# EAGLE design tx_board (EAGLE 7.7.0)
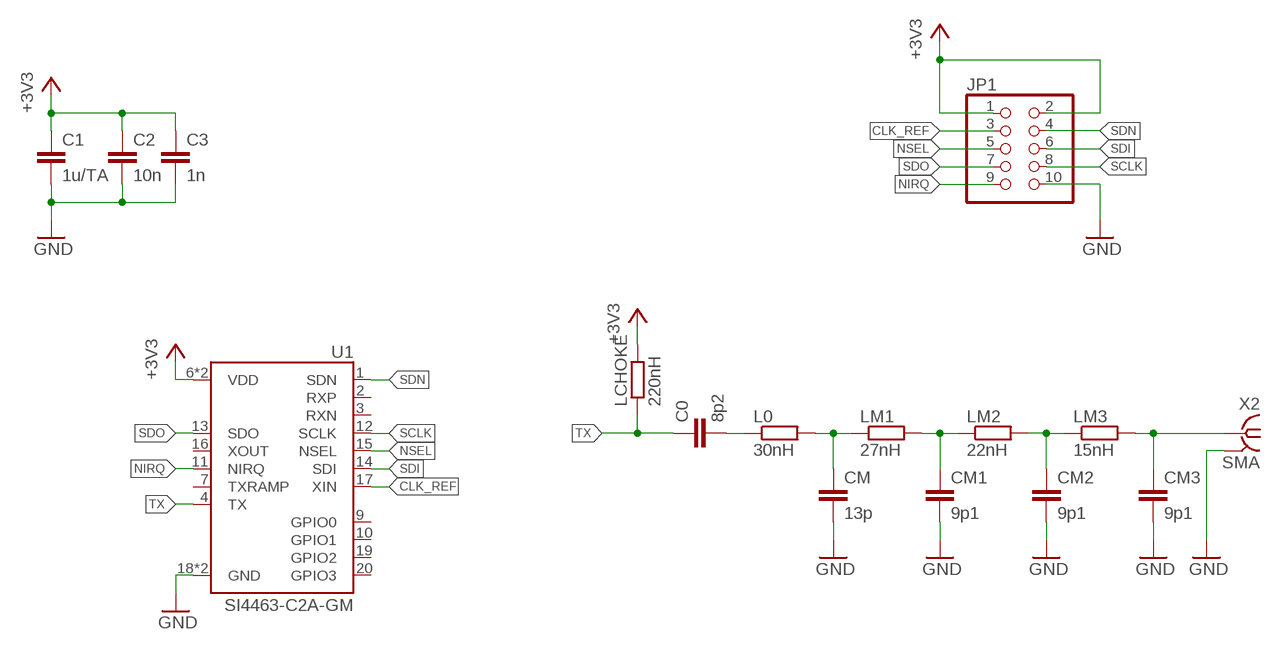
[diagram p0: schematic, sheet 1]

## Parts
C0  8p2  C-EUC0805  [C0805]
C1  1u/TA  C-EUC1206  [C1206]
C2  10n  C-EUC0805  [C0805]
C3  1n  C-EUC0805  [C0805]
CM  13p  C-EUC0805  [C0805]
CM1  9p1  C-EUC0805  [C0805]
CM2  9p1  C-EUC0805  [C0805]
CM3  9p1  C-EUC0805  [C0805]
JP1  PINHD-2X5/90  [2X05/90]
L0  30nH  R-EU_R0805  [R0805]
LCHOKE  220nH  R-EU_R0805  [R0805]
LM1  27nH  R-EU_R0805  [R0805]
LM2  22nH  R-EU_R0805  [R0805]
LM3  15nH  R-EU_R0805  [R0805]
U1  SI4463-C2A-GM  [QFN50P400X400X90-20N]
X2  SMA  SMA-142-0701-871/876  [J502-ND-142-0701-871/876]

## Nets
+3V3 [pwr]: C1.1 C2.1 C3.1 JP1.1 JP1.2 LCHOKE.2 U1.6(VDD) U1.8(VDD)
CLK_REF: JP1.3 U1.17(XIN)
GND [pwr]: C1.2 C2.2 C3.2 CM1.2 CM2.2 CM3.2 CM.2 JP1.10 U1.18(GND) U1.21(GND) X2.G@1 X2.G@2 X2.G@3 X2.G@4
N$2: CM2.1 LM2.2 LM3.1
N$21 [rf]: CM3.1 LM3.2 X2.1
N$23 [rf]: C0.2 L0.1
N$24 [rf]: CM.1 L0.2 LM1.1
N$25 [rf]: CM1.1 LM1.2 LM2.1
NIRQ: JP1.9 U1.11(NIRQ)
NSEL: JP1.5 U1.15(NSEL)
SCLK: JP1.8 U1.12(SCLK)
SDI: JP1.6 U1.14(SDI)
SDN: JP1.4 U1.1(SDN)
SDO: JP1.7 U1.13(SDO)
TX: C0.1 LCHOKE.1 U1.4(TX)
Unconnected: U1.2(RXP) U1.3(RXN) U1.7(TXRAMP) U1.9(GPIO0) U1.10(GPIO1) U1.16(XOUT) U1.19(GPIO2) U1.20(GPIO3)

## Library data of the parts
C0 C1-C3 CM CM1-CM3 = rcl:C-EU: CAPACITOR, European symbol
JP1 = pinhead:PINHD-2X5: PIN HEADER
L0 LCHOKE LM1-LM3 = resistor:R-EU_: RESISTOR, European symbol
U1 = SI4463-C2A-GM:SI4463-C2A-GM: RF Transceiver FSK/GFSK/GMSK/MSK/OOK 3.3V 20-Pin QFN EP; AVAILABILITY: Unavailable; DESCRIPTION: RF Transceiver FSK/GFSK/GMSK/MSK/OOK 3.3V 20-Pin QFN EP; MF: Silicon Labs; MP: SI4463-C2A-GM; PACKAGE: VFQFN-20 Silicon Labs; PRICE: None
X2 = con-coax:SMA-: SMA 50 Ohm End Launch Jack Receptacle - Round Contact Johnson Components Source: www.johnsoncomponents.com .. J502-ND.pdf; MF: JOHNSON COMPONENTS; MPN: 142-0701-871; OC_FARNELL: 1339835; OC_NEWARK: 91B6105

## Net classes
1 pwr: width 0.5 mm, drill 0.2 mm, clearance 0.127 mm
2 rf: width 0.5 mm, drill 0.2 mm, clearance 0.1 mm

## Board
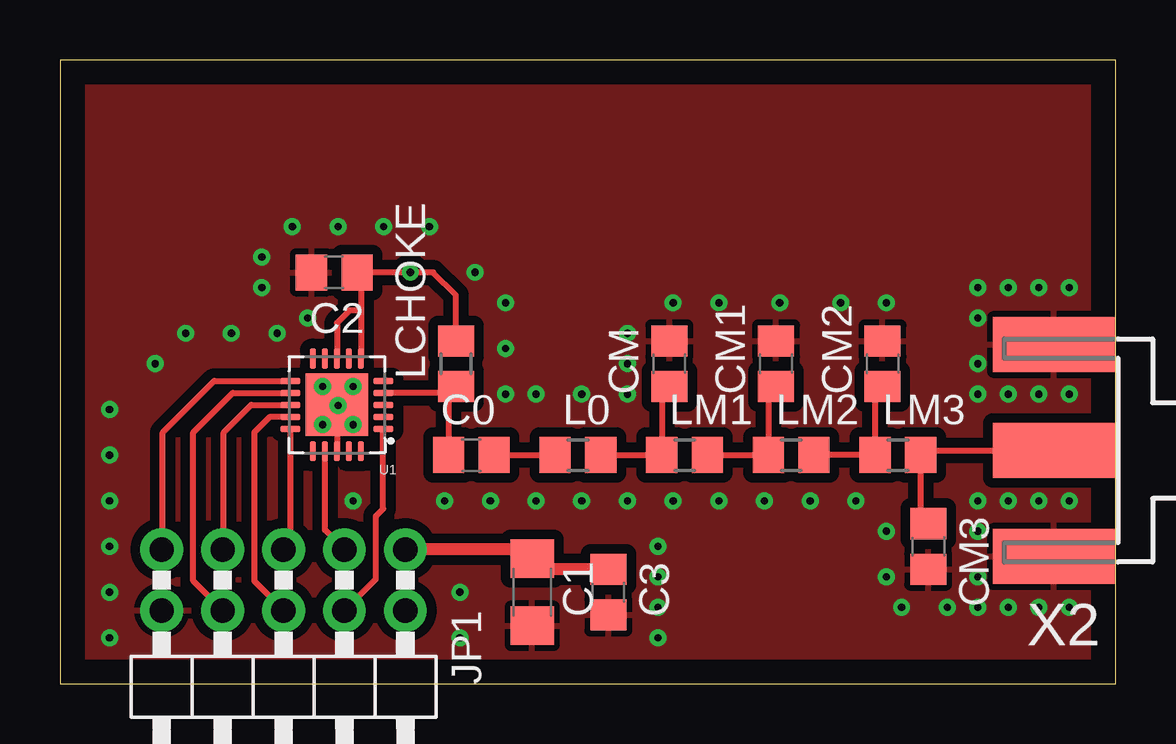
[diagram p1: board, top side]
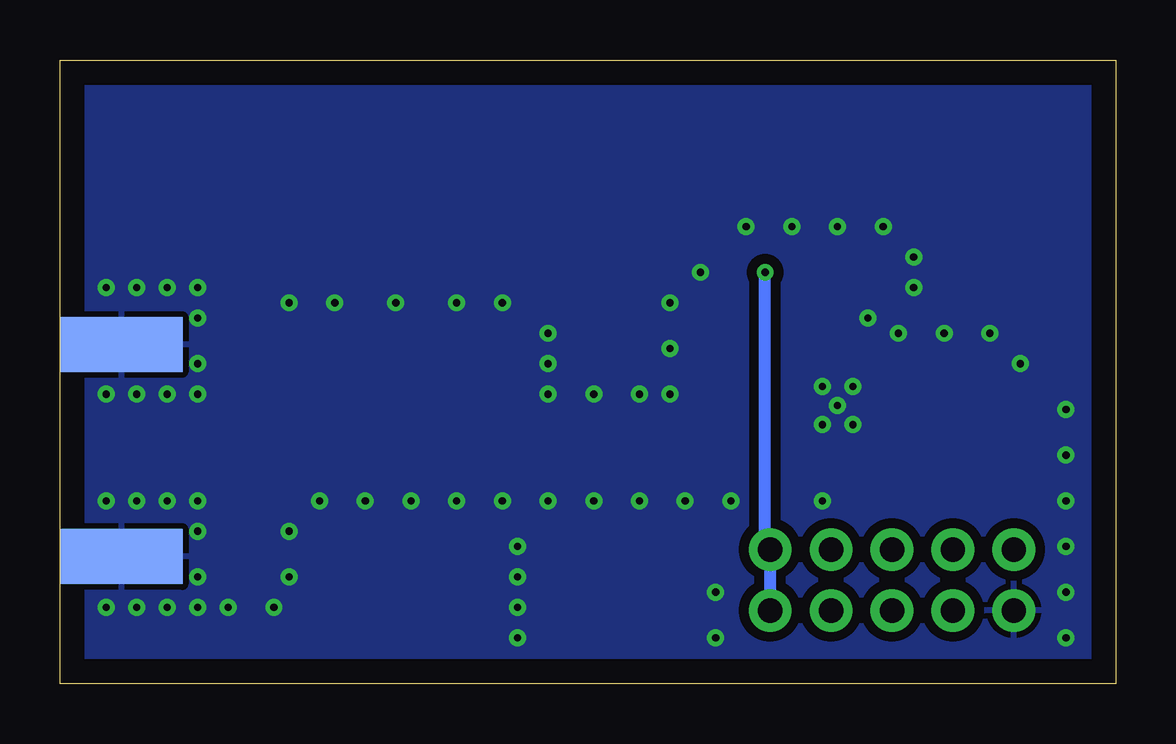
[diagram p2: board, bottom side, seen from below]

Size 44 x 26 mm. Coordinates in mm from the lower left corner, seen from the top.
Outline: 0,0 44,0 44,26 0,26 0,0
Copper layers (1*16): Top 0.035mm / dielectric 1.5mm / Bottom 0.035mm
Design rules "default *": minimum track width 10mil, minimum drill 24mil, track to track 8mil, track to pad 8mil, pad to pad 8mil, via to via 8mil, smd to smd 8mil, copper to edge 40mil, drill to drill 8mil, minimum pad ring 10mil, minimum via ring 8mil, stop-mask expansion 4mil, vias tented up to drill 0.3mm, thermal gap 10mil

### Footprints (pad centres in the part's own frame; a part is rotated, then mirrored left to right if it is on the bottom)
C0805 = smd 1.3 x 1.5: 1 -0.95,0; 2 0.95,0
C1206 = smd 1.6 x 1.8: 1 -1.4,0; 2 1.4,0
2X05/90 = drill 1.016 pad 1.778: 1 -5.08,-6.35; 2 -5.08,-3.81; 3 -2.54,-6.35; 4 -2.54,-3.81; 5 0,-6.35; 6 0,-3.81; 7 2.54,-6.35; 8 2.54,-3.81; 9 5.08,-6.35; 10 5.08,-3.81
R0805 = smd 1.3 x 1.5: 1 -0.95,0; 2 0.95,0
QFN50P400X400X90-20N = smd 0.84 x 0.26: 1 -1.935,1; 2 -1.935,0.5; 3 -1.935,0; 4 -1.935,-0.5; 5 -1.935,-1; 11 1.935,-1; 12 1.935,-0.5; 13 1.935,0; 14 1.935,0.5; 15 1.935,1 | smd 0.26 x 0.84: 6 -1,-1.935; 7 -0.5,-1.935; 8 0,-1.935; 9 0.5,-1.935; 10 1,-1.935; 16 1,1.935; 17 0.5,1.935; 18 0,1.935; 19 -0.5,1.935; 20 -1,1.935 | smd 2.6 x 2.6: 21 0,0
J502-ND-142-0701-871/876 = smd 5.08 x 2.286: 1 2.565,0; G@1 2.565,4.42; G@2 2.565,-4.42 | smd 5.08 x 2.286 bottom: G@3 2.565,4.42; G@4 2.565,-4.42

### Placement (x,y rotation side)
C0  17.14,9.53 0 top
C1  19.68,3.81 270 top
C2  11.43,17.14 180 top
C3  22.86,3.81 270 top
CM  25.4,13.34 90 top
CM1  29.84,13.34 90 top
CM2  34.29,13.34 90 top
CM3  36.2,5.71 270 top
JP1  9.32,-0.76 180 top
L0  21.59,9.53 0 top
LCHOKE  16.51,13.34 90 top
LM1  26.04,9.53 0 top
LM2  30.48,9.53 0 top
LM3  34.92,9.53 0 top
U1  11.54,11.62 180 top
X2  44,9.71 180 top

### Tracks (layer width: path | path; a pad name or v marks a point on that pad's centre or on a via)
+3V3  (via drill 0.3)
  Top 0.254: 12.54,15.56 12.54,17.14 C2.1 v14.61,17.14 15.56,17.14 16.51,16.19 LCHOKE.2 | 12.54,15.56 U1.6 | 12.54,15.56 12.06,15.56 11.54,15.04 U1.8
  Top 0.508: C3.1 20,4.76 19.68,5.08 C1.1 19.31,5.59 JP1.1
  Bottom 0.508: v14.61,17.14 14.61,5.79 JP1.1 JP1.2
CLK_REF
  Top 0.254: JP1.3 11.04,6.41 U1.17
GND  (via drill 0.3)
  Top 0.254: U1.18 U1.21 11.54,11.79 v10.95,12.38
  other vias: 12.22,12.38 12.22,10.79 10.95,10.79 11.59,11.59 2.06,1.91 2.06,3.81 2.06,5.71 2.06,7.62 2.06,9.53 2.06,11.43 3.97,13.34 5.24,14.61 7.14,14.61 9.05,14.61 12.22,7.62 16.03,7.62 17.94,7.62 19.84,7.62 21.75,7.62 23.65,7.62 16.67,3.81 16.67,1.91 25.56,7.62 27.46,7.62 29.37,7.62 31.27,7.62 33.18,7.62 34.45,6.35 34.45,4.45 35.08,3.17 36.99,3.17 42.07,7.62 40.8,7.62 39.53,7.62 38.26,7.62 38.26,6.35 38.26,4.45 38.26,3.17 39.53,3.17 40.8,3.17 42.07,3.17 42.07,12.06 40.8,12.06 39.53,12.06 38.26,12.06 38.26,13.34 38.26,15.24 38.26,16.51 39.53,16.51 40.8,16.51 42.07,16.51 34.45,15.88 30,15.88 25.56,15.88 27.46,15.88 32.54,15.88 23.65,14.61 23.65,13.34 23.65,12.06 21.75,12.06 19.84,12.06 18.57,12.06 18.57,13.97 18.57,15.88 10.32,15.24 8.41,16.51 8.41,17.78 9.68,19.05 11.59,19.05 13.49,19.05 15.4,19.05 17.3,17.14 24.92,1.91 24.92,3.17 24.92,4.45 24.92,5.71
  pour Top (isolate 0.406): 0,26.04 43.97,26.04 43.97,0 0,0
  pour Bottom (isolate 0.406): 0,26.04 43.97,26.04 43.97,0 0,0
N$2
  Top 0.254: CM2.1 33.98,12.07 LM3.1 LM2.2
N$21
  Top 0.254: X2.1 36.06,9.71 LM3.2 35.88,6.99 CM3.1
N$23
  Top 0.254: C0.2 L0.1
N$24
  Top 0.254: L0.2 LM1.1 25.09,12.07 CM.1
N$25
  Top 0.254: CM1.1 29.53,12.07 LM2.1 LM1.2
NIRQ
  Top 0.254: JP1.9 4.29,5.63 4.29,10.48 6.43,12.62 U1.11
NSEL
  Top 0.254: JP1.5 9.61,5.88 U1.15
SCLK
  Top 0.254: JP1.8 5.56,4.27 5.56,10.48 7.2,12.12 U1.12
SDI
  Top 0.254: JP1.6 8.1,4.27 8.1,10.48 8.73,11.11 U1.14
SDN
  Top 0.254: JP1.4 13.18,4.36 13.18,6.99 13.48,7.29 U1.1
SDO
  Top 0.254: JP1.7 6.83,5.63 6.83,10.48 7.97,11.62 U1.13
TX
  Top 0.254: U1.4 16.25,12.12 LCHOKE.1 16.2,12.07 C0.1

### Text on the board
tDocu: REP_TX_BOARD_1.0